# EAGLE schematic schematic (EAGLE 9.0.0)
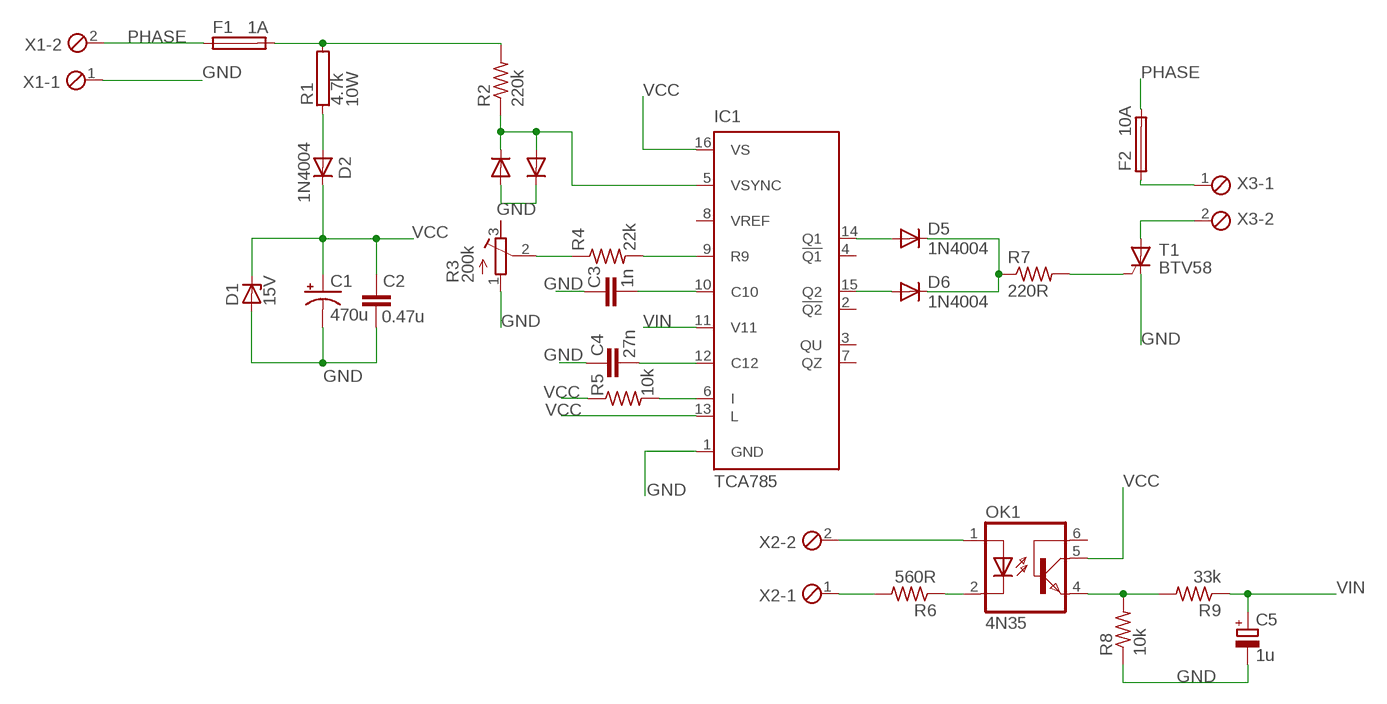
[diagram p0: schematic, sheet 1]

## Parts
C1  470u  CPOL-USE3.5-8  [E3,5-8]
C2  0.47u  C-EU025-025X050  [C025-025X050]
C3  1n  C-EU025-025X050  [C025-025X050]
C4  27n  C-EU025-025X050  [C025-025X050]
C5  1u  CPOL-EUE2,5-6E  [E2,5-6E]
D1  15V  BZY97  [F126Z12]
D2  1N4004  [DO41-10]
D3  1N4004  [DO41-10]
D4  1N4004  [DO41-10]
D5  1N4004  [DO41-10]
D6  1N4004  [DO41-10]
F1  1A  SH25  [SH25]
F2  10A  SH25  [SH25]
IC1  TCA785  [DIL16]
OK1  4N35  [DIL06]
R1  4.7k  RAC10  [AC10]
R2  220k  R-US_0207/10  [0207/10]
R3  200k  R-TRIMM64W  [RTRIM64W]
R4  22k  R-US_0207/10  [0207/10]
R5  10k  R-US_0207/15  [0207/15]
R6  560R  R-US_0204/7  [0204/7]
R7  220R  R-US_0207/15  [0207/15]
R8  10k  R-US_0207/12  [0207/12]
R9  33k  R-US_0207/12  [0207/12]
T1  BTV58  [TO220CS]
X1  MPT2  [2POL254]
X2  MPT2  [2POL254]
X3  MPT2  [2POL254]

## Nets
GND: C1.- C2.1 C3.1 C4.1 C5.- D1.A D3.A D4.C IC1.1(GND) R3.1(A) R8.1 T1.C X1.1
N$1: D2.A R1.1
N$2: R3.2(S) R4.1
N$3: D3.C D4.A IC1.5(VSYNC) R2.1
N$4: IC1.9(R9) R4.2
N$5: C4.2 IC1.12(C12)
N$6: C3.2 IC1.10(C10)
N$7: IC1.6(I) R5.2
N$8: D6.A IC1.15(Q2)
N$9: D5.A IC1.14(Q1)
N$10: D5.C D6.C R7.1
N$11: R7.2 T1.G
N$12: F2.1 X3.1
N$13: F1.2 R1.2 R2.2
N$14: T1.A X3.2
N$15: OK1.4(EMI) R8.2 R9.2
N$16: R6.2 X2.1
N$17: OK1.2(C) R6.1
N$18: OK1.1(A) X2.2
PHASE: F1.1 F2.2 X1.2
VCC: C1.+ C2.2 D1.C D2.C IC1.13(L) IC1.16(VS) OK1.5(COL) R5.1
VIN: C5.+ IC1.11(V11) R9.1
Unconnected: IC1.2(!Q2) IC1.3(QU) IC1.4(!Q1) IC1.7(QZ) IC1.8(VREF) OK1.6(BAS) R3.3(E)

## Library data of the parts
C1 = resistor:CPOL-US: POLARIZED CAPACITOR, American symbol
C2-C4 = resistor:C-EU: CAPACITOR, European symbol
C5 = resistor:CPOL-EU: POLARIZED CAPACITOR, European symbol
D1 = diode:BZY97: Z DIODE
D2-D6 = diode:1N4004: DIODE general purpose rectifier, 1 A
F1 F2 = fuse:SH25: FUSE HOLDER grid 25 mm, OGN0031 8211, Schurter (Buerklin); MF: SCHURTER; MPN: 0031.8211; OC_FARNELL: 1162741; OC_NEWARK: 96B9380
IC1 = TCA785:TCA785: Phase Control IC Source: http://www.infineon.com/ .. tca785.pdf; AVAILABILITY: Unavailable; MF: Infineon Technologies; MP: TCA785; PACKAGE: DIP-16 Siemens; PRICE: None
OK1 = optocoupler:4N35: MOTOROLA OPTO COUPLER; MF: FAIRCHILD SEMICONDUCTOR; MPN: 4N35; OC_FARNELL: 1328375; OC_NEWARK: 72K9946
R1 = resistor-power:R: Power Resitor; OC_FARNELL: unknown; OC_NEWARK: unknown; P: 10W
R2 = resistor:R-US_: RESISTOR, American symbol; SPICEPREFIX: R
R3 = resistor:R-TRIMM: Trimm resistor
R4-R9 = resistor:R-US_: RESISTOR, American symbol
T1 = triac:BTV58: THYRISTOR
X1-X3 = con-phoenix-254:MPT2: PHOENIX CONNECTOR; OC_FARNELL: unknown; OC_NEWARK: unknown